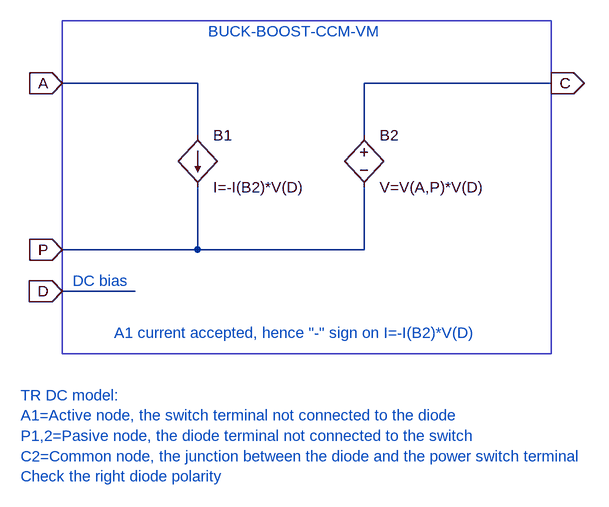
[diagram p0: schematic BUCK-BOOST-CCM-VM.asc]
BUCK-BOOST-CCM-VM.asc, the LTspice schematic file:
Version 4
SHEET 1 928 680
WIRE 224 -144 16 -144
WIRE 768 -144 480 -144
WIRE 224 -64 224 -144
WIRE 480 -64 480 -144
WIRE 224 112 224 16
WIRE 224 112 16 112
WIRE 480 112 480 16
WIRE 480 112 224 112
WIRE 128 176 16 176
FLAG 16 -144 A
IOPIN 16 -144 In
FLAG 16 112 P
IOPIN 16 112 In
FLAG 768 -144 C
IOPIN 768 -144 Out
FLAG 16 176 D
IOPIN 16 176 In
SYMBOL bi 224 -64 R0
SYMATTR InstName B1
SYMATTR Value I=-I(B2)*V(D)
SYMBOL bv 480 -80 R0
SYMATTR InstName B2
SYMATTR Value V=V(A,P)*V(D)
TEXT 240 -224 Left 0 ;BUCK-BOOST-CCM-VM
TEXT -48 336 Left 0 ;TR DC model:\nA1=Active node, the switch terminal not connected to the diode\nP1,2=Pasive node, the diode terminal not connected to the switch\nC2=Common node, the junction between the diode and the power switch terminal\nCheck the right diode polarity
TEXT 96 240 Left 0 ;A1 current accepted, hence "-" sign on I=-I(B2)*V(D)
TEXT 32 160 Left 0 ;DC bias
RECTANGLE Normal 768 272 16 -240

The netlist it stands for:
* BUCK-BOOST-CCM-VM.asc
B1 A P I=-I(B2)*V(D)
B2 C P V=V(A,P)*V(D)
* BUCK-BOOST-CCM-VM
* TR DC model:
* A1=Active node, the switch terminal not connected to the diode
* P1,2=Pasive node, the diode terminal not connected to the switch
* C2=Common node, the junction between the diode and the power switch terminal
* Check the right diode polarity
* A1 current accepted, hence "-" sign on I=-I(B2)*V(D)
* DC bias
.backanno
.end